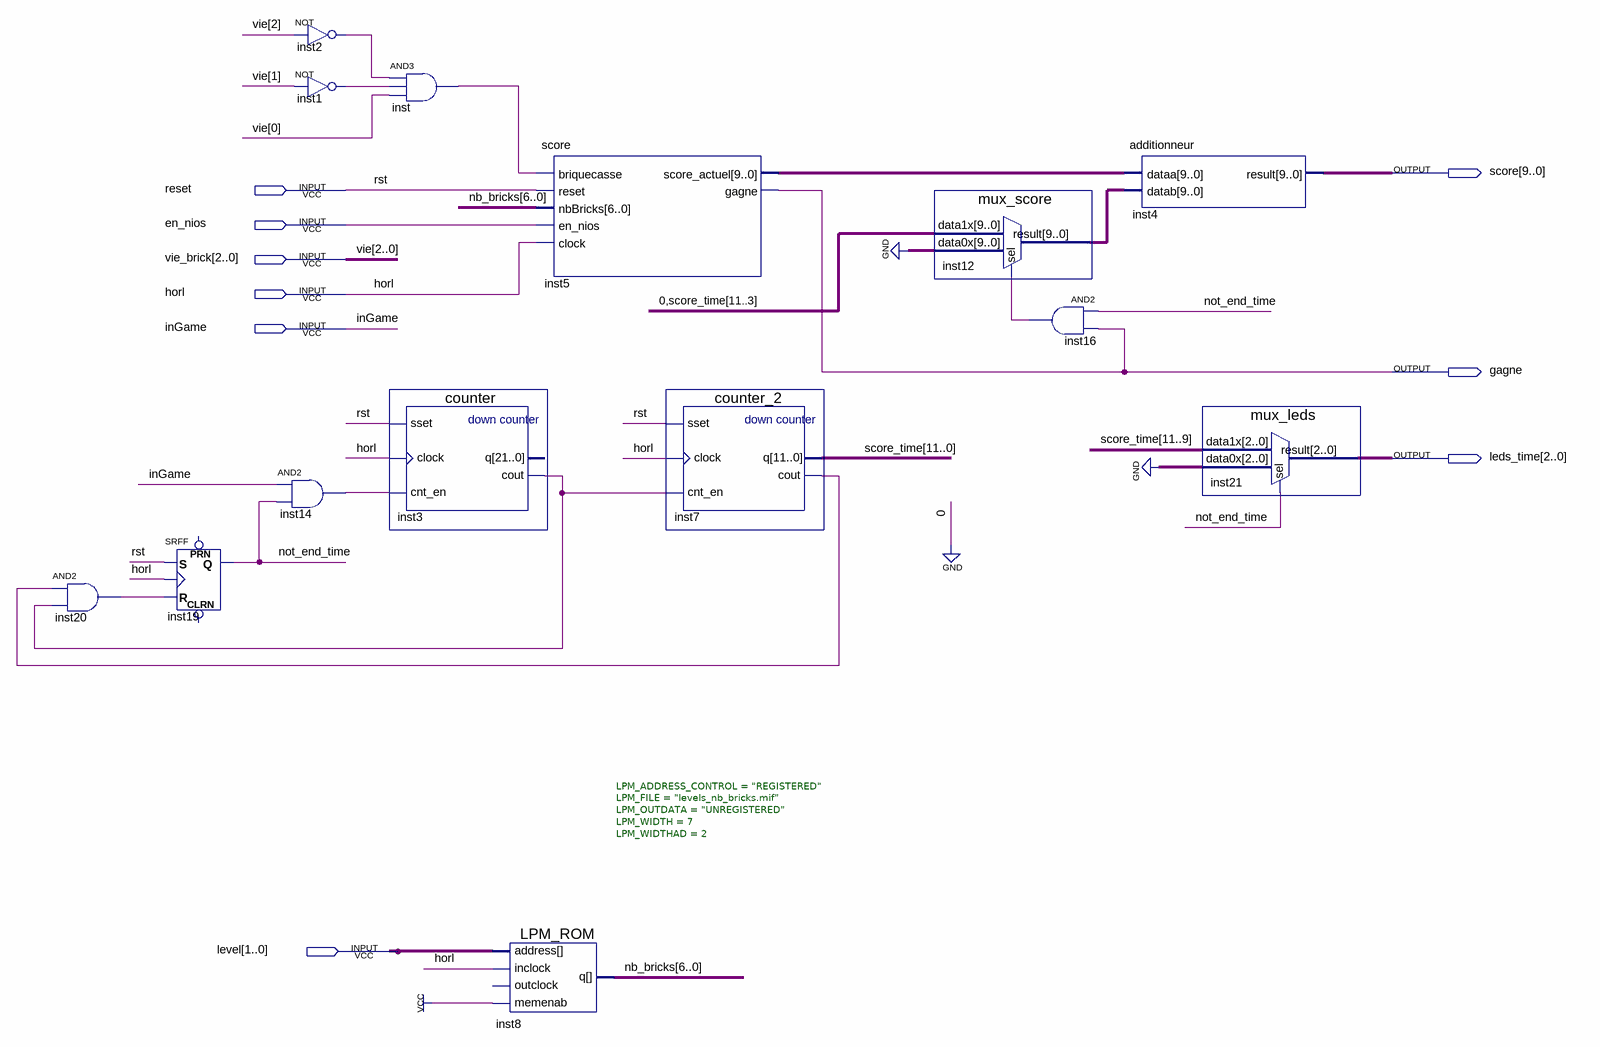
[diagram p0: schematic sheet]
// Quartus schematic Compteur_score.bdf as structural Verilog: 14 symbols, 9 pins
module Compteur_score (
  input  reset,
  input  en_nios,
  input  [2:0] vie_brick,
  input  horl,
  input  inGame,
  input  [1:0] level,
  output [9:0] score,
  output gagne,
  output [2:0] leds_time
);

  wire inst1_out, inst2_out, inst3_cout, inst7_cout, inst14_out, inst16_out, inst20_out, inst_out,
       not_end_time;
  wire [6:0] nb_bricks;
  wire [9:0] inst5_score_actuel, inst12_result;
  wire [11:0] score_time;

  and inst20 (inst20_out, inst7_cout, inst3_cout);
  SRFF inst19 (.S(reset), .R(inst20_out), .CLK(horl), .Q(not_end_time));  // open: PRN, CLRN
  not inst2 (inst2_out, vie_brick[2]);
  not inst1 (inst1_out, vie_brick[1]);
  and inst14 (inst14_out, inGame, not_end_time);
  and inst (inst_out, inst2_out, inst1_out, vie_brick[0]);
  counter inst3 (.sset(reset), .clock(horl), .cnt_en(inst14_out), .cout(inst3_cout));  // open: q
  LPM_ROM #(.LPM_ADDRESS_CONTROL("REGISTERED"), .LPM_FILE("levels_nb_bricks.mif"), .LPM_OUTDATA("UNREGISTERED"), .LPM_WIDTH(7), .LPM_WIDTHAD(2)) inst8 (
    .address(level), .inclock(horl), .memenab(1'b1), .q(nb_bricks));  // open: outclock
  score inst5 (
    .briquecasse(inst_out), .reset(reset), .nbBricks(nb_bricks), .en_nios(en_nios), .clock(horl),
    .score_actuel(inst5_score_actuel), .gagne(gagne));
  counter_2 inst7 (.sset(reset), .clock(horl), .cnt_en(inst3_cout), .cout(inst7_cout), .q(score_time));
  mux_score inst12 (.data1x({1'b0, score_time[11:3]}), .data0x({10{1'b0}}), .sel(inst16_out), .result(inst12_result));
  and inst16 (inst16_out, not_end_time, gagne);
  additionneur inst4 (.dataa(inst5_score_actuel), .datab(inst12_result), .result(score));
  mux_leds inst21 (.data1x(score_time[11:9]), .data0x(3'b000), .sel(not_end_time), .result(leds_time));

  // Other names for the same wires on the sheet: rst = reset; vie[2:0] = vie_brick
endmodule
